# Altium schematic sheet Antenne.SchDoc
size A
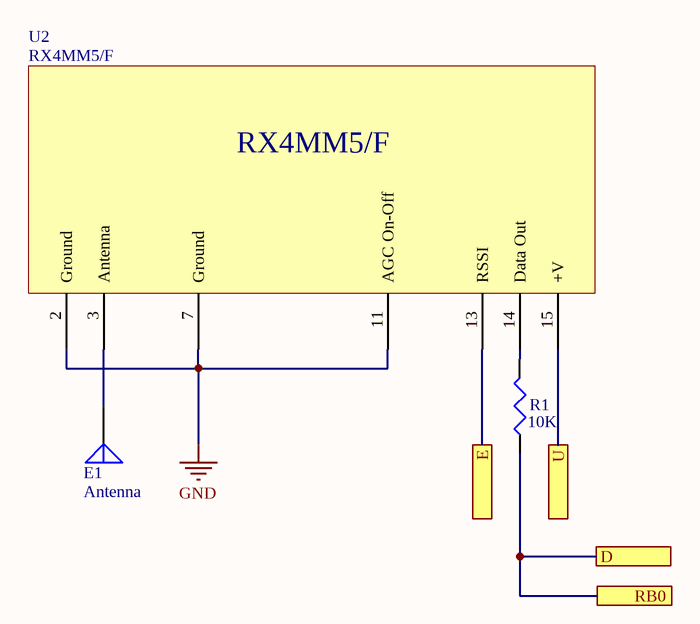
[diagram p0: Antenne.SchDoc]

## Parts
E1  Antenna  [PIN1]
R1  value 10K  [J1-0603]  (hidden comment: Res3)
U2  RX4MM5/F  [RX4MM5/F]

## Ports
D, E, RB0, U

## Nets
GND: U2.2(Ground) U2.7(Ground) U2.11(AGC_On-Off)
D: R1.1 ; port RB0, port D
E: U2.13(RSSI) ; port E
U: U2.15(+V) ; port U
NetE1_1: E1.1(A) U2.3(Antenna)
NetR1_2: R1.2 U2.14(Data_Out)

## Library data of the parts
E1 = Antenna: Generic Antenna; Published: 24-Mar-1999; LatestRevisionDate: 17-Jul-2002; LatestRevisionNote: Re-released for DXP Platform.; PackageReference: PIN1; Publisher: Altium Limited
R1 = Res3: Resistor; Published: 8-Jun-2000; LatestRevisionDate: 29-May-2009; LatestRevisionNote: IPC-7351 Footprint Added.; PackageReference: J1-0603; Publisher: Altium Limited; PackageDescription: Chip Resistor
U2 = RX4MM5/F: RF Signal Receiver; LatestRevisionDate: 25-Oct-2012; DatasheetVersion: 2012; PackageReference: TO-92A; Publisher: FJ Custom; ComponentLink1Description: Manufacturer Link; ComponentLink1URL: https://www.aurelwireless.com/; ComponentLink2Description: Datasheet